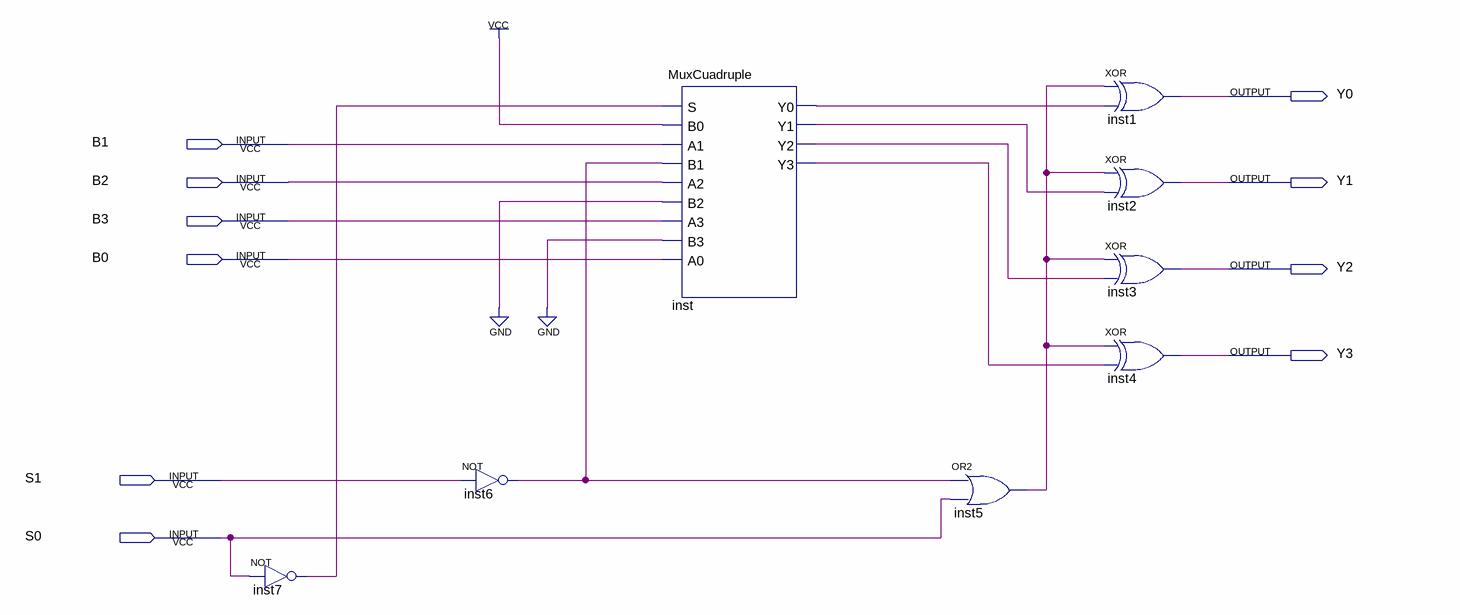
[diagram p0: schematic sheet]
// Quartus schematic BLOQUEY.bdf as structural Verilog: 8 symbols, 10 pins
module BLOQUEY (
  input  B1,
  input  B2,
  input  B3,
  input  B0,
  input  S1,
  input  S0,
  output Y0,
  output Y1,
  output Y2,
  output Y3
);

  wire inst5_out, inst6_out, inst7_out, inst_y0, inst_y1, inst_y2, inst_y3;

  not inst7 (inst7_out, S0);
  not inst6 (inst6_out, S1);
  MuxCuadruple inst (
    .S(inst7_out), .B0(1'b1), .A1(B1), .B1(inst6_out), .A2(B2), .B2(1'b0), .A3(B3), .B3(1'b0), .A0(B0),
    .Y0(inst_y0), .Y1(inst_y1), .Y2(inst_y2), .Y3(inst_y3));
  or inst5 (inst5_out, inst6_out, S0);
  xor inst1 (Y0, inst5_out, inst_y0);
  xor inst2 (Y1, inst5_out, inst_y1);
  xor inst3 (Y2, inst5_out, inst_y2);
  xor inst4 (Y3, inst5_out, inst_y3);
endmodule
